# Altium schematic sheet Adafruit_LSM6DSOX.SchDoc: Adafruit_LSM6DSOX
size 282 x 210 mm; COMPANY: ADAFRUIT INDUSTRIES; DRAWN: KTOWN; REV: A; Origin: Eagle; OriginPath: C:\Users\HP i7\Downloads\Adafruit_LSM6DSOX.sch; OriginSheet: 1; Date: 11/4/2025 7:14:35 PM; SheetNumber: 1; Author: >AUTHOR; GateName_1: G$1; SymbolName_1: FRAME_A4_ADAFRUIT; LibraryName: microbuilder; DeviceSetName: FRAME_A4_ADAFRUIT; Sheet: Sheet:; AdafruitIndustries: Adafruit Industries; Drawing: Drawing:
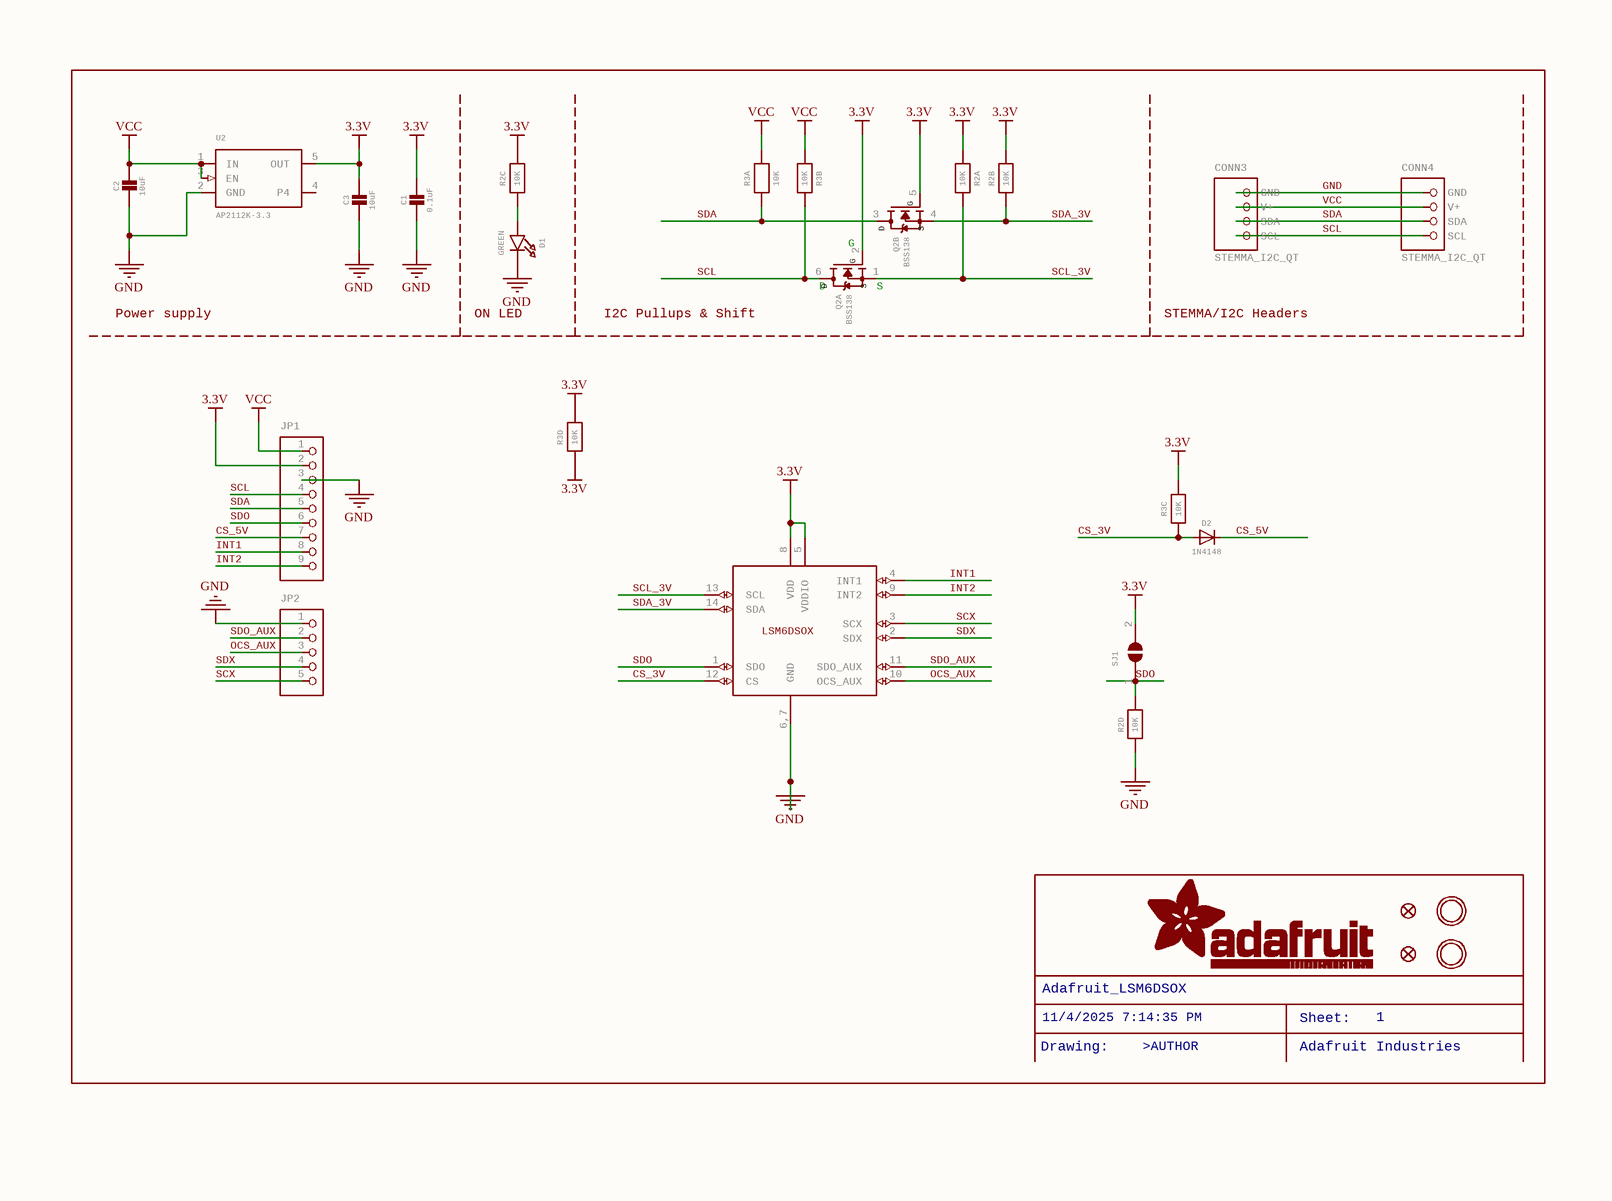
[diagram p0: Adafruit_LSM6DSOX.SchDoc]

## Parts
C1  0.1uF  [0603-NO]
C2  10uF  [0805-NO]
C3  10uF  [0805-NO]
CONN3  STEMMA_I2C_QT  [JST_SH4]
CONN4  STEMMA_I2C_QT  [JST_SH4]
D1  GREEN  [CHIPLED_0603_NOOUTLINE]
D2  1N4148  [SOD-323]
FID3  FIDUCIAL_1MM  [FIDUCIAL_1MM]  (value not drawn)
FID4  FIDUCIAL_1MM  [FIDUCIAL_1MM]  (value not drawn)
JP1  HEADER-1X970MIL  [1X09_ROUND_70]  (value not drawn)
JP2  HEADER-1X570MIL  [1X05_ROUND_70]  (value not drawn)
Q2  BSS138  [SOT363]  (parts A,B of 2)
R2  10K  [RESPACK_4X0603]  (parts A,B,C,D of 4)
R3  10K  [RESPACK_4X0603]  (parts A,B,C,D of 4)
SJ1  SOLDERJUMPER  [SOLDERJUMPER_ARROW_NOPASTE]  (value not drawn)
U2  AP2112K-3.3  [SOT23-5]
U$1  MOUNTINGHOLE2.5  [MOUNTINGHOLE_2.5_PLATED]  (value not drawn)
U$2  LSM6DSOX  [LGA-14L]
U$17  MOUNTINGHOLE2.5  [MOUNTINGHOLE_2.5_PLATED]  (value not drawn)

## Nets
3.3V: C1.1 C3.1 JP1.2 Q2.2(G) Q2.5(G) R2.1 R2.2 R2.6 R3.3 R3.4 R3.5 SJ1.2 U2.5(OUT) U$2.5(VDDIO) U$2.8(VDD)
GND: C1.2 C2.2 C3.2 CONN3.1(GND) CONN4.1(GND) D1.C JP1.3 JP2.1 R2.4 U2.2(GND) U$2.6,7(GND)
VCC: C2.1 CONN3.2(V+) CONN4.2(V+) JP1.1 R3.7 R3.8 U2.1(IN) U2.3(EN)
CS_3V: D2.A R3.6 U$2.12(CS)
CS_5V: D2.C JP1.7
INT1: JP1.8 U$2.4(INT1)
INT2: JP1.9 U$2.9(INT2)
OCS_AUX: JP2.3 U$2.10(OCS_AUX)
SCL: CONN3.4(SCL) CONN4.4(SCL) JP1.4 Q2.6(D) R3.2
SCL_3V: Q2.1(S) R2.8 U$2.13(SCL)
SCX: JP2.5 U$2.3(SCX)
SDA: CONN3.3(SDA) CONN4.3(SDA) JP1.5 Q2.3(D) R3.1
SDA_3V: Q2.4(S) R2.7 U$2.14(SDA)
SDO: JP1.6 R2.5 SJ1.1 U$2.1(SDO)
SDO_AUX: JP2.2 U$2.11(SDO_AUX)
SDX: JP2.4 U$2.2(SDX)
NetD1_A: D1.A R2.3

Not connected (* = marked no-connect by the designer): U2 4(P4)

## Notes on the sheet
- (near Q2) D
- (near Q2) G
- (near Q2) S
- Power supply
- ON LED
- I2C Pullups & Shift
- STEMMA/I2C Headers
- Adafruit_LSM6DSOX
- Drawing:
- 11/4/2025 7:14:35 PM
- >AUTHOR
- Sheet:
- Adafruit Industries
- 1

## Library data of the parts
C1 = CAP_CERAMIC0603_NO: Ceramic Capacitors   For new designs, use the packages preceded by an '_' character since they are more reliable:   The following footprints should be used on most boards: _0402 - Standard footprint for regular board layouts  _0603 - Standard footprint for regular board layouts  _0805 - Standard footprint for regular board layouts  _1206 - Standard footprint for regular board layouts       For extremely tight-pitch boards where space is at a premium, the following 'micro-pitch' footprints can be used (smaller pads, no silkscreen outline, etc.): _0402MP - Micro-pitch footprint for very dense/compact boards  _0603MP - Micro-pitch footprint for very dense/compact boards  _0805MP - Micro-pitch footprint for very dense/compact boards  _1206MP - Micro-pitch footprint for very dense/compact boards; GateName_1: G$1; SymbolName_1: CAPACITOR; DeviceName: 0603_NO; LibraryName: microbuilder; DeviceSetName: CAP_CERAMIC
C2 C3 = CAP_CERAMIC0805-NOOUTLINE: Ceramic Capacitors   For new designs, use the packages preceded by an '_' character since they are more reliable:   The following footprints should be used on most boards: _0402 - Standard footprint for regular board layouts  _0603 - Standard footprint for regular board layouts  _0805 - Standard footprint for regular board layouts  _1206 - Standard footprint for regular board layouts       For extremely tight-pitch boards where space is at a premium, the following 'micro-pitch' footprints can be used (smaller pads, no silkscreen outline, etc.): _0402MP - Micro-pitch footprint for very dense/compact boards  _0603MP - Micro-pitch footprint for very dense/compact boards  _0805MP - Micro-pitch footprint for very dense/compact boards  _1206MP - Micro-pitch footprint for very dense/compact boards; GateName_1: G$1; SymbolName_1: CAPACITOR; DeviceName: 0805-NOOUTLINE; LibraryName: microbuilder; DeviceSetName: CAP_CERAMIC
CONN3 CONN4 = STEMMA_I2C_QT: GateName_1: G$1; DeviceName: _QT; SymbolName_1: STEMMA_I2C; LibraryName: microbuilder; DeviceSetName: STEMMA_I2C
D1 = LED0603_NOOUTLINE: LED0603 - 0603 Surface Mount Package    2mA: Green LED - Low Power (3.9mcd, 2ma, 1.7Vf) - Digikey: 475-2709-2-ND  Orange LED - Low Power (9.8mcd, 2ma, 1.8Vf) - Digikey: 475-1194-2-ND  Red LED - Low Power (5mcd, 2ma, 1.8Vf) - Digikey: 475-1195-2-ND  Yellow LED - Low Power (7mcd, 2ma, 1.8Vf) - Digikey: 475-1196-2-ND       5mA: Blue LED - Low Power (17mcd, 5ma, 2.9Vf) - Digikey: LNJ937W8CRACT-ND    0805 - 0805 Surface Mount Package    2mA: Red LED (8.8mcd, 2mA, 1.8Vf, Clear) - Low Power [Digikey: 475-2510-1-ND]  Green LED (5mcd, 2mA, 1.8Vf, Clear) - Low Power [Digikey: 475-2730-1-ND]  Yellow LED (11.3mcd, 2mA, 1.8Vf, Clear) - Low Power [Digikey: 475-2555-1-ND]       20mA: Red LED (104mcd, 20mA, Diffused) - LS R976 [Digikey: 475-1278-6-ND]  Red LED (12mcd, 20mA, 2.0Vf, Clear) - APT2012EC [Digikey: 754-1128-1-ND]  Green LED (15mcd, 20mA, 2.2Vf, Clear) - APT2012GC [Digikey: 754-1131-1-ND]  Orange LED (160mcd, 20mA, 2.1Vf, Clear) - APT2012SECK [Digikey: 754-1130-1-ND]     1206 - 1206 Surface Mount Package  Green LED (26mcd, 20mA, Diffused) - LG N971  [Digikey: 475-1407-6-ND]  Red LED (15mcd, 20mA, Diffused) - LH N974 [Digikey: 475-1416-6-ND]     Cree - Cree High-Power Surface Mount LEDs  XPEBWT-L1-0000-00D50 - White 111lm 350mA 2.9Vf 6200K 110Â°  XTEAWT-00-0000-00000LEE3 - White 114lm 350mA 2.85Vf 5000K 115Â°     Everlight - Everlight 45-21 Series Surface Mount LEDs  45-21/QK2C-B2832AC2CB2/2T - Warm White 2000mcd 20mA 3.25Vf 3050K 120Â°  45-21/LK2C-B38452C4CB2/2T - Nuetral White 2000mcd 20mA 3.25Vf 4150K 120Â°  45-21/LK2C-B50634C6CB2/2T - Cold White 2200mcd 20mA 3.25Vf 5650K 120Â°     PLCC2 Reverse Mount LS T77K-J1L2-1-0-2-R18-Z - Red 11.25mcd 2mA 1.8Vf 630nm 120Â°  LO T77K-L1M2-24-Z - Orange 19.6mcd 2mA 1.8Vf 606nm 120Â°  LY T77K-K2M1-26-Z - Yellow 15.7mcd 2mA 1.8Vf 587nm 120Â°; GateName_1: G$1; SymbolName_1: LED; DeviceName: 0603_NOOUTLINE; LibraryName: microbuilder; DeviceSetName: LED
D2 = DIODESOD-323: Diode    SMA      Model	  Volts	  Amps	  Type	  Vf	  Ir	  Digikey #	  Notes	     SSA34-E3	  40V	  3A	  Schottky	  480mV @ 3A	  200uA @ 40V	  SSA34-E3/61TGITR-ND	  	     CDBA120-G	  20V	  1A	  Schottky	  500mV @ 1A	  500uA @ 20V	  641-1014-6-ND	  REEL	     MBRA210	  10V	  2A	  Schottky	  350mV @ 2A	  700uA @ 10V	  MBRA210LT3	  	 SOD-123      Model	  Volts	  Amps	  Type	  Vf	  Ir	  Order #	  Notes	     BAT54T1G	  30V	  200mA	  Schottky	  800mV @ 200mA	  2uA @ 25V	  BAT54T1GOSTR-ND	  	     B0530W	  30V	  500mA	  Schottky	  430mV @ 500mA	  130uA @ 30V	  B0530W-FDICT-ND	  REEL	     MBR120	  20V	  1A	  Schottky	  340mV @ 1A	  	  MBR120VLSFT1GOSCT-ND	  	 SOD-323      Model	  Volts	  Amps	  Type	  Vf	  Ir	  Order #	  Notes	     PMEG2005EJ	  20V	  500mA	  Schottky	  355mV @ 500mA	  	  568-4110-1-ND	  	     ZLLS410	  10V	  570mA	  Schottky	  380mV @ 570mA	  	  ZLLS410CT-ND	  	     1N4148WS	  75V	  150mA	  Silicon/Simple	  1V	  	  1N4148WSFSCT-ND	  REEL	 SOD-523      Model	  Volts	  Amps	  Type	  Vf	  Ir	  Order #	  Notes	     BAT54XV2	  30V	  200mA	  Schottky	  0.8V @ 100mA	  	  BAT54XV2CT-ND	  	     TB751S	  30V	  30mA	  Schottky	  	  	  RB751S-40TE61CT-ND	  	 SOT23-R/W (R = Solder Paste/Reflow Ovens, W = Hand-Soldering)       Model	  Volts	  Amps	  Type	  Vf	  Ir	  Order #	  Notes	     BAT54FILM	  40V	  300mA	  Schottky	  	  	  497-7162-1-ND	  	 POWERDI-5       Model	  Volts	  Amps	  Type	  Vf	  Ir	  Order #	  Notes	     PDS560	  60V	  5A	  Schottky	  670mV @ 5A	  150uA @ 60V	  PDS560DICT-ND; GateName_1: G$1; SymbolName_1: DIODE; DeviceName: SOD-323; LibraryName: microbuilder; DeviceSetName: DIODE
FID3 FID4 = FIDUCIAL_1MM: Fiducial Alignment Points   Various fiducial points for machine vision alignment.; GateName_1: G$1; DeviceName: _1MM; BOM: EXCLUDE; SymbolName_1: FIDUCIAL; LibraryName: microbuilder; DeviceSetName: FIDUCIAL
JP1 = HEADER-1X970MIL: PIN HEADER; GateName_1: A; SymbolName_1: PINHD9; DeviceName: 70MIL; LibraryName: microbuilder; DeviceSetName: HEADER-1X9
JP2 = HEADER-1X570MIL: PIN HEADER; GateName_1: A; SymbolName_1: PINHD5; DeviceName: 70MIL; LibraryName: microbuilder; DeviceSetName: HEADER-1X5
Q2 = MOSFET-N_DUAL: Dual N-Channel MOSFET   SOT363 (2.0x1.25mm) 2N7002PS - 60V, 320mA [Digikey: 568-5984-1-ND]; GateName_1: G$1; GateName_2: G$2; SymbolName_1: MOSFET-N; SymbolName_2: MOSFET-N; LibraryName: microbuilder; DeviceSetName: MOSFET-N_DUAL; D: D; S: S; G: G
R2 R3 = RESISTOR_4PACK: Resistor Packs (4 resistors)   4 x 0603 10K 1/16W - Digikey: YC164J-10KCT-ND; GateName_1: G$1; GateName_2: G$2; GateName_3: G$3; GateName_4: G$4; SymbolName_1: RESISTOR; SymbolName_2: RESISTOR; SymbolName_3: RESISTOR; SymbolName_4: RESISTOR; LibraryName: microbuilder; DeviceSetName: RESISTOR_4PACK
SJ1 = SOLDERJUMPER: SMD Solder JUMPER   Solder the two pads together to create a connection, or remove the solder to break it.REFLOW - Use this footprint for solder paste and reflow ovens. WAVE - Use this footprint for hand-soldering (larger pads).    CLOSED - Has a trace between the two pads to ensure it is closed by default.  The trace needs to be cut to disable the jumper, and can be closed again by creating a solder bridge between the two pads.; GateName_1: 1; BOM: EXCLUDE; SymbolName_1: SOLDERJUMPER; LibraryName: microbuilder; DeviceSetName: SOLDERJUMPER
U2 = VREG_SOT23-5: SOT23-5 Fixed Voltage Regulators      Part	Current Out	V Out	V In	V Dropout	Î¸JA (Â°C/W)	TJ (Â°C)	Digikey Part No.	     ADP121	  150mA	  3.3V	  3.4-5.5V	  0.09V @ 150mA	  --	  --	  ADP121-AUJZ33R7CT-ND	     ADP121	  150mA	  3.0V	  3.1-5.5V	  0.09V @ 150mA	  --	  --	  ADP121-AUJZ30R7CT-ND	     ADP122	  300mA	  3.3V	  3.4-5.5V	  0.085V @ 300mA	  --	  --	  ADP122AUJZ-3.3-R7CT-ND	     ADP1712	  300mA	  3.3V	  3.5-5.5V	  0.17V @ 300mA	  --	  --	  ADP1712AUJZ-3.3-R7TR-ND	     AP7311 (Low Cost)	  150mA	  3.3V	  3.5-6V	  0.15V @ 150mA	  --	  --	  AP7311-33WG-7DICT-ND	     LD39015M18R	  150mA	  1.8V	  1.9V-5.5V	  0.08V @ 100mA	  --	  --	  497-6977-1-ND	     LP2985A-33DBVR	  150mA	  3.3V	  3.3-16V	  0.28V @ 150mA	  206	  150	  296-18479-1-ND	     MCP1824T-3302E/OT	  300mA	  3.3V	  3.5V-6V	  0.2V @ 300mA	  --	  --	  MCP1824T-3302E/OTCT-ND	     MIC5205-2.5YM5 TR	  150mA	  2.5V	  2.7-16V	  0.165V @ 150mA	  --	  --	  576-1257-2-ND	     MIC5205-3.0YM5 TR	  150mA	  3.0V	  3.2V-16V	  0.165V @ 150mA	  --	  --	  576-1258-2-ND	     MIC5205-3.3YM5 TR	  150mA	  3.3V	  3.5V-16V	  0.165V @ 150mA	  --	  --	  576-1259-2-ND	     TPS780330220	  150mA	  3.3V+2.2V	  3.6-5.5V	  250mV Max	  --	  --	  296-23332-1-ND	     TDA3663/N1,135	  100mA	  3.3V	  3.5-45V	  0.18V @ 50mA	  --	  --	  568-5343-1-ND	     	  	  	  	  	  	  	  	     	  	  	  	  	  	  	  	   Max operating temp can be calculated using Î¸JA, TJ (max junction temperature), and power in watts.  Set the "Maximum Ambient Temperature" until it reaches TJ ("Max Junction Temperature"), which is the absolute limit for safe use of the regulator: Heat Sink Temperature Calculator   For example, With 12V source into a 3.3V LP2985 and a 30mA load, we are dissipating (12V-3.3V) * 0.03A = 0.261W.  With a Î¸JA of 206 Â°C/W, a TJ of 150Â°C, and 261mW we can safely use the chip without a heat sink up to 75Â°C (=147.1Â°C Junction Temperature).; GateName_1: G$1; SymbolName_1: VREG_SOT23-5; LibraryName: microbuilder; DeviceSetName: VREG_SOT23-5
U$1 U$17 = MOUNTINGHOLE2.5: Mounting Hole   For #2 screws (0.086"/2.18mm width, 0.094"/2.4mm hole) use 2.5mm; GateName_1: G$1; DeviceName: 2.5; BOM: EXCLUDE; SymbolName_1: MOUNTINGHOLE; LibraryName: microbuilder; DeviceSetName: MOUNTINGHOLE
U$2 = LSM6DSOX: GateName_1: G$1; SymbolName_1: LSM6DSOX; LibraryName: microbuilder; DeviceSetName: LSM6DSOX; LSM6DSOX: LSM6DSOX